# Altium schematic sheet KONMAI_Cardreader.SchDoc
size A4; SheetNumber: 1; SheetTotal: 1
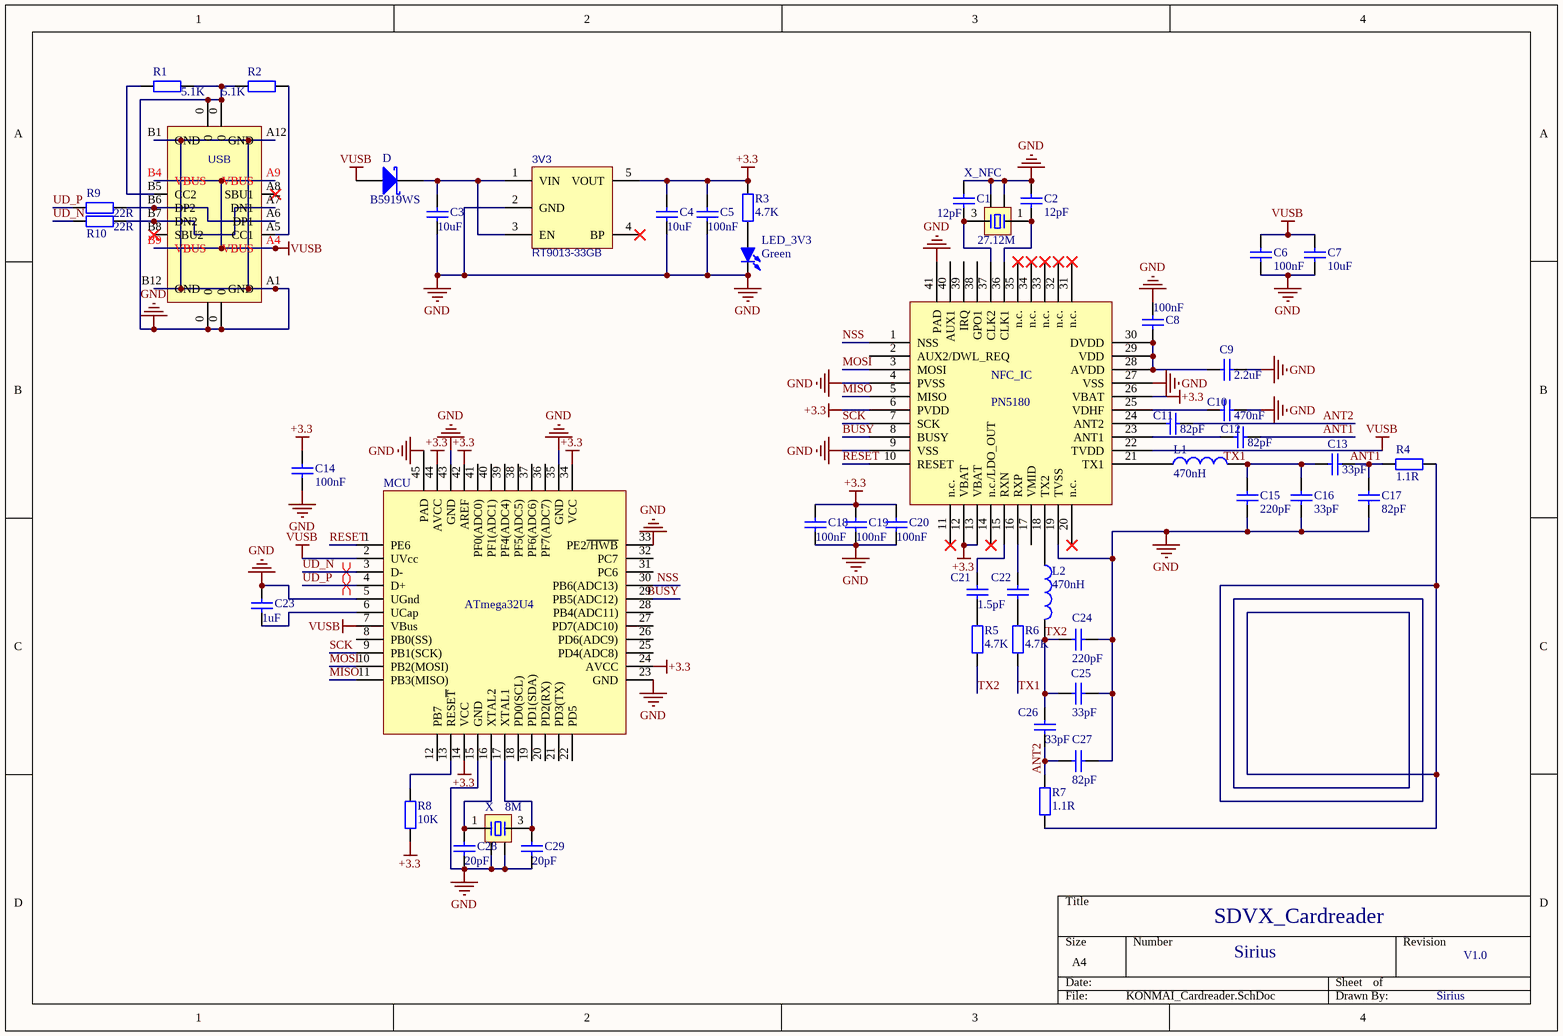
[diagram p0: KONMAI_Cardreader.SchDoc]

## Parts
3V3  RT9013-33GB  [SOT-23-5]
C1  12pF  [C0603_L]
C2  12pF  [C0603_L]
C3  10uF  [C0603_L]
C4  10uF  [C0603_L]
C5  100nF  [C0603_L]
C6  100nF  [C0603_L]
C7  10uF  [C0603_L]
C8  100nF  [C0603_L]
C9  2.2uF  [C0603_L]
C10  470nF  [C0603_L]
C11  82pF  [C0603_L]
C12  82pF  [C0603_L]
C13  33pF  [C0603_L]
C14  100nF  [C0603_L]
C15  220pF  [C0603_L]
C16  33pF  [C0603_L]
C17  82pF  [C0603_L]
C18  100nF  [C0603_L]
C19  100nF  [C0603_L]
C20  100nF  [C0603_L]
C21  1.5pF  [C0603_L]
C22  1.5pF  [C0603_L]  (value not drawn)
C23  1uF  [C0603_L]
C24  220pF  [C0603_L]
C25  33pF  [C0603_L]
C26  33pF  [C0603_L]
C27  82pF  [C0603_L]
C28  20pF  [C0603_L]
C29  20pF  [C0603_L]
D  B5919WS  [SOD-323]
L1  470nH  [L0603]
L2  470nH  [L0603]
LED_3V3  Green  [LED0603_G]
MCU  ATmega32U4  [44PW_ATM-M]
NFC_IC  PN5180  [QFN40_PN5180_NXP-L]
R1  5.1K  [R0603_L]
R2  5.1K  [R0603_L]
R3  4.7K  [R0603_L]
R4  1.1R  [R0603_L]
R5  4.7K  [R0603_L]
R6  4.7K  [R0603_L]
R7  1.1R  [R0603_L]
R8  10K  [R0603_L]
R9  22R  [R0603_L]
R10  22R  [R0603_L]
USB  TYPE-C 2.0 -16P  [USB-C-SMD_16P]  (value not drawn)
X  8M  [XTAL-3225-4P]
X_NFC  27.12M  [XTAL-3225-4P]

## Nets
+3.3: 3V3.5(VOUT) C4.2 C5.2 C14.2 C18.2 C19.2 C20.2 MCU.14(VCC) MCU.24(AVCC) MCU.34(VCC) MCU.42(AREF) MCU.44(AVCC) NFC_IC.6(PVDD) NFC_IC.12(VBAT) NFC_IC.13(VBAT) NFC_IC.26(VBAT) R3.2 R8.1
GND: 3V3.2(GND) C1.1 C2.1 C3.1 C4.1 C5.1 C6.2 C7.2 C8.2 C9.1 C10.2 C14.1 C15.1 C16.2 C17.1 C18.1 C19.1 C20.1 C23.1 C24.1 C25.2 C27.2 C28.1 C29.1 LED_3V3.2(K) MCU.5(UGnd) MCU.15(GND) MCU.23(GND) MCU.33(PE2~{/HWB}) MCU.35(GND) MCU.43(GND) MCU.45(PAD) NFC_IC.4(PVSS) NFC_IC.9(VSS) NFC_IC.19(TVSS) NFC_IC.27(VSS) NFC_IC.41(PAD) R1.2 R2.1 USB.0 USB.A1(GND) USB.A12(GND) USB.B1(GND) USB.B12(GND) X.2 X.4 X_NFC.2 X_NFC.4
VUSB: C6.1 C7.1 D.1(A) MCU.2(UVcc) MCU.7(VBus) NFC_IC.22(TVDD) USB.A4(VBUS) USB.A9(VBUS) USB.B4(VBUS) USB.B9(VBUS)
ANT1: C12.1 C13.1 C17.2 R4.2
ANT2: C11.1 C26.2 C27.1 R7.1
BUSY: MCU.29(PB5(ADC12)) NFC_IC.8(BUSY)
MISO: MCU.11(PB3(MISO)) NFC_IC.5(MISO)
MOSI: MCU.10(PB2(MOSI)) NFC_IC.3(MOSI)
NSS: MCU.30(PB6(ADC13)) NFC_IC.1(NSS)
RESET: MCU.1(PE6) NFC_IC.10(RESET)
SCK: MCU.9(PB1(SCK)) NFC_IC.7(SCK)
TX1: C13.2 C15.2 C16.1 L1.2 R6.1
TX2: C24.2 C25.1 C26.1 L2.2 R5.1
UD_N: MCU.3(D-) R10.1
UD_P: MCU.4(D+) R9.1
Net3V3_1: 3V3.1(VIN) 3V3.3(EN) C3.2 D.2(K)
NetC1_2: C1.2 NFC_IC.37(CLK2) X_NFC.3
NetC2_2: C2.2 NFC_IC.36(CLK1) X_NFC.1
NetC8_1: C8.1 C9.2 NFC_IC.28(AVDD) NFC_IC.29(VDD) NFC_IC.30(DVDD)
NetC10_1: C10.1 NFC_IC.25(VDHF)
NetC11_2: C11.2 NFC_IC.24(ANT2)
NetC12_2: C12.2 NFC_IC.23(ANT1)
NetC21_1: C21.1 R5.2
NetC21_2: C21.2 NFC_IC.15(RXN)
NetC22_1: C22.1 R6.2
NetC22_2: C22.2 NFC_IC.16(RXP)
NetC23_2: C23.2 MCU.6(UCap)
NetC28_2: C28.2 MCU.16(XTAL2) X.1
NetC29_2: C29.2 MCU.17(XTAL1) X.3
NetL1_1: L1.1 NFC_IC.21(TX1)
NetL2_1: L2.1 NFC_IC.18(TX2)
NetLED_3V3_1: LED_3V3.1(A) R3.1
NetMCU_13: MCU.13(RESE~{T}) R8.2
NetR1_1: R1.1 USB.B5(CC2)
NetR2_2: R2.2 USB.A5(CC1)
NetR4_1: R4.1 R7.2
NetR9_2: R9.2 USB.A6(DP1) USB.B6(DP2)
NetR10_2: R10.2 USB.A7(DN1) USB.B7(DN2)

Not connected (* = marked no-connect by the designer): 3V3 4(BP)*; MCU 8(PB0(SS)) 12(PB7) 18(PD0(SCL)) 19(PD1(SDA)) 20(PD2(RX)) 21(PD3(TX)) 22(PD5) 25(PD4(ADC8)) 26(PD6(ADC9)) 27(PD7(ADC10)) 28(PB4(ADC11)) 31(PC6) 32(PC7) 36(PF7(ADC7)) 37(PF6(ADC6)) 38(PF5(ADC5)) 39(PF4(ADC4)) 40(PF1(ADC1)) 41(PF0(ADC0)); NFC_IC 2(AUX2/DWL_REQ) 11(n.c.)* 14(n.c./LDO_OUT)* 17(VMID) 20(n.c.)* 31(n.c.)* 32(n.c.)* 33(n.c.)* 34(n.c.)* 35(n.c.)* 38(GPO1) 39(IRQ) 40(AUX1); USB A8(SBU1)* B8(SBU2)*

## Layout directives
differential pair: UD_N, UD_P

## Notes on the sheet
- SDVX_Cardreader
- Sirius
- V1.0

## Library data of the parts
3V3 = RT9193-30GB: LDO 3.0V/0.3A; 芯片厂商: RICHTEK; 封装库来自淘宝卖家 ID：黄晶宝石: 其他店铺购入均为盗版，请立即申请退款，本店现金奖励5~20元; 联系卖家 免费查找封装: 唯一出售店铺网址https://shop463601444.taobao.com; BOM名称: RT9193-30GB
C1-C5 C10-C13 C15-C17 C21-C29 = C: 贴片电容; BOM名称: 无极性贴片电容; 联系卖家，免费查找封装: 唯一出售店铺网址https://shop463601444.taobao.com; 封装库来自淘宝卖家ID：黄晶宝石: 其他店铺购入均为盗版假冒封装库，请立即申请退款
C6 C7 = C: TVDD续流电容; BOM名称: 无极性贴片电容; 联系卖家，免费查找封装: 唯一出售店铺网址https://shop463601444.taobao.com; 封装库来自淘宝卖家ID：黄晶宝石: 其他店铺购入均为盗版假冒封装库，请立即申请退款
C8 = C: DVDD滤波; BOM名称: 无极性贴片电容; 联系卖家，免费查找封装: 唯一出售店铺网址https://shop463601444.taobao.com; 封装库来自淘宝卖家ID：黄晶宝石: 其他店铺购入均为盗版假冒封装库，请立即申请退款
C9 = C: AVDD滤波; BOM名称: 无极性贴片电容; 联系卖家，免费查找封装: 唯一出售店铺网址https://shop463601444.taobao.com; 封装库来自淘宝卖家ID：黄晶宝石: 其他店铺购入均为盗版假冒封装库，请立即申请退款
C14 = C: AREF滤波电容; BOM名称: 无极性贴片电容; 联系卖家，免费查找封装: 唯一出售店铺网址https://shop463601444.taobao.com; 封装库来自淘宝卖家ID：黄晶宝石: 其他店铺购入均为盗版假冒封装库，请立即申请退款
C18-C20 = C: VBAT滤波; BOM名称: 无极性贴片电容; 联系卖家，免费查找封装: 唯一出售店铺网址https://shop463601444.taobao.com; 封装库来自淘宝卖家ID：黄晶宝石: 其他店铺购入均为盗版假冒封装库，请立即申请退款
D = 1N5819: 肖特基二极管; 联系卖家，免费查找封装: 唯一出售店铺网址https://shop463601444.taobao.com; BOM名称: 肖特基二极管
L1 L2 = L: 贴片小功率电感; BOM名称: 小功率贴片电感; 联系卖家，免费查找封装: 唯一出售店铺网址https://shop463601444.taobao.com
LED_3V3 = LED-SMD: 贴片LED; 封装库来自淘宝卖家 ID：黄晶宝石: 其他店铺购入均为假冒，请立即申请退款，本店奖励现金5~20元; 联系卖家 免费技术支持: 唯一出售店铺网址https://shop463601444.taobao.com; BOM名称: 贴片LED
MCU = ATmega32U4: AVR单片机; 联系卖家，免费技术支持: 唯一出售店铺网址https://shop463601444.taobao.com
NFC_IC = PN5180: NFC_IC
R1 R2 R4-R7 R9 R10 = R: 贴片电阻; 联系卖家，免费查找封装: 唯一出售店铺网址https://shop463601444.taobao.com; BOM名称: 贴片电阻
R3 R8 = R: 贴片电阻; 联系卖家，免费查找封装: 唯一出售店铺网址https://shop463601444.taobao.com; 封装库来自淘宝卖家ID：黄晶宝石: 其他店铺购入均为盗版假冒封装库，请立即申请退款; BOM名称: 贴片电阻
USB = USB2.0_Type-C_16Pin: USB2.0 Type-C 16Pin  母座; 联系卖家，免费技术支持: 唯一出售店铺网址https://shop463601444.taobao.com
X X_NFC = XTAL-4P: 4脚无源晶振(谐振器）; 联系卖家，免费查找封装: 唯一出售店铺网址https://shop463601444.taobao.com; BOM名称: 4脚无源晶振(谐振器）